# Altium schematic sheet 四开关buck-boost主电路.SchDoc
size A4
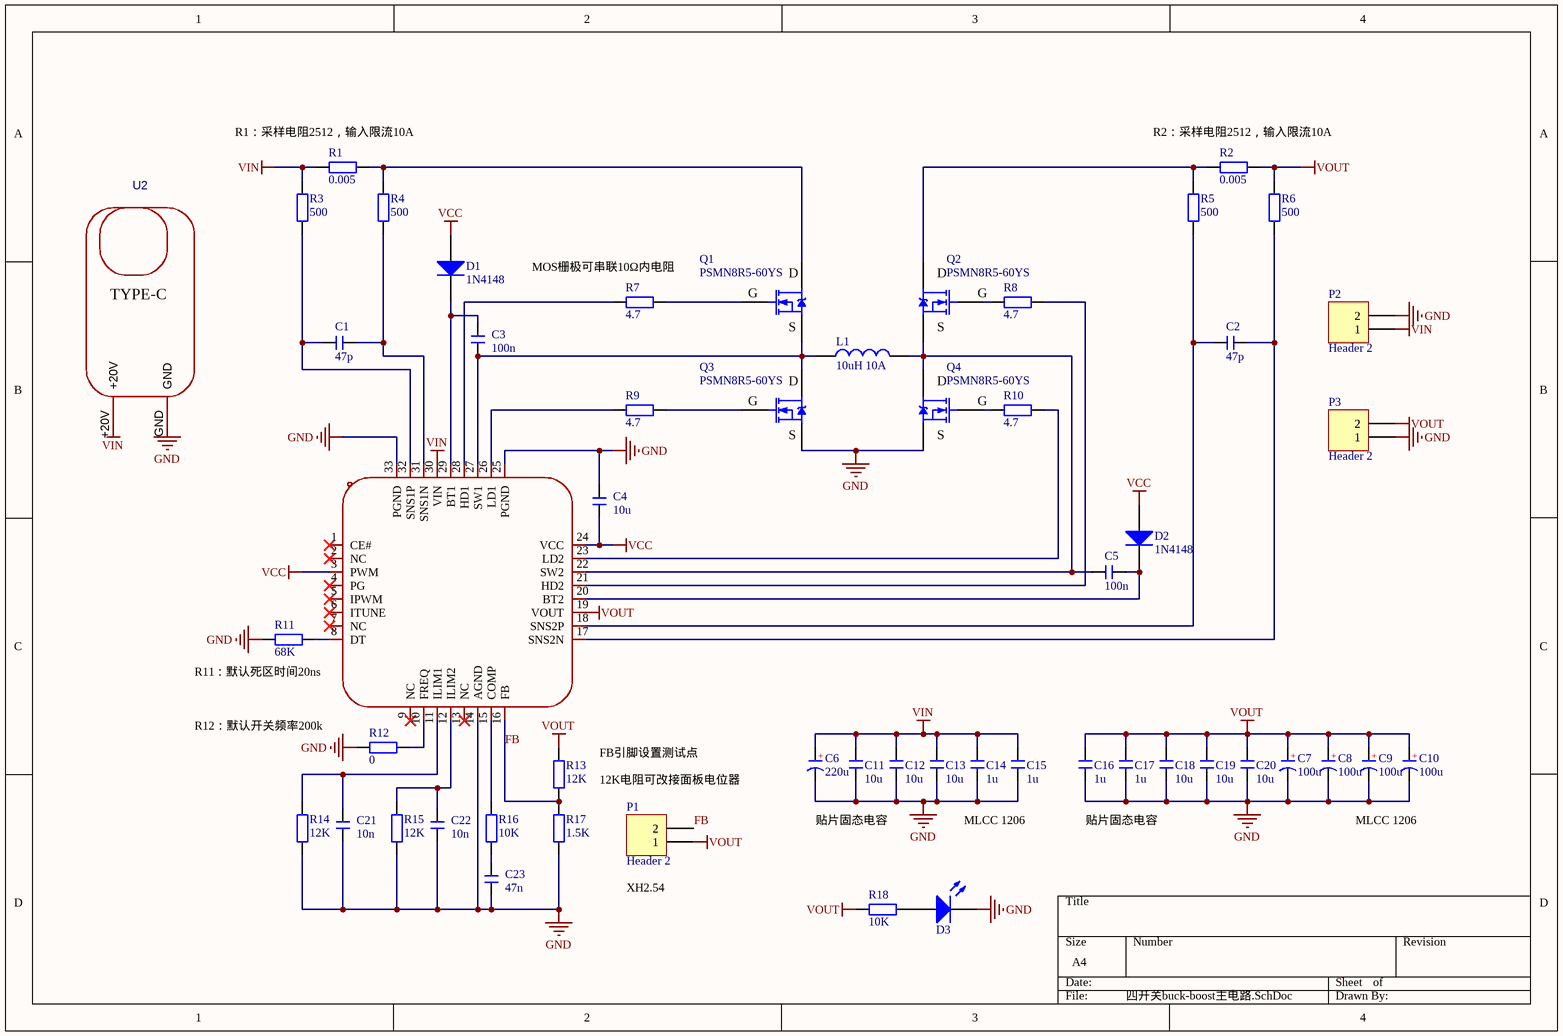
[diagram p0: 四开关buck-boost主电路.SchDoc]

## Parts
C1  47p  [C 0603_M]
C2  47p  [C 0603_M]
C3  100n  [C 0603_M]
C4  10u  [C 0603_M]
C5  100n  [C 0603_M]
C6  220u  [CM F(10*10.2)]
C7  100u  [CM E(8*10.2)]
C8  100u  [CM E(8*10.2)]
C9  100u  [CM E(8*10.2)]
C10  100u  [CM E(8*10.2)]
C11  10u  [C 1206_M]
C12  10u  [C 1206_M]
C13  10u  [C 1206_M]
C14  1u  [C 1206_M]
C15  1u  [C 1206_M]
C16  1u  [C 1206_M]
C17  1u  [C 1206_M]
C18  10u  [C 1206_M]
C19  10u  [C 1206_M]
C20  10u  [C 1206_M]
C21  10n  [C 0603_M]
C22  10n  [C 0603_M]
C23  47n  [C 0603_M]
D1  1N4148  [SOD-323]
D2  1N4148  [SOD-323]
D3  LED  [LED 0603G]  (value not drawn)
L1  10uH 10A  [IND-SMD_L13.8-W12.6_SMMS1360]
P1  Header 2  [HDR1X2]
P2  Header 2  [CONN-TH_2P-P3.81_WJ15EDGRC-3.81-2P]
P3  Header 2  [CONN-TH_2P-P3.81_WJ15EDGRC-3.81-2P]
Q1  PSMN8R5-60YS  [SOT669]
Q2  PSMN8R5-60YS  [SOT669]
Q3  PSMN8R5-60YS  [SOT669]
Q4  PSMN8R5-60YS  [SOT669]
R1  0.005  [R 2512_M]
R2  0.005  [R 2512_M]
R3  500  [R 0603_M]
R4  500  [R 0603_M]
R5  500  [R 0603_M]
R6  500  [R 0603_M]
R7  4.7  [R 0603_M]
R8  4.7  [R 0603_M]
R9  4.7  [R 0603_M]
R10  4.7  [R 0603_M]
R11  68K  [R 0603_M]
R12  0  [R 0603_M]
R13  12K  [R 0603_M]
R14  12K  [R 0603_M]
R15  12K  [R 0603_M]
R16  10K  [R 0603_M]
R17  1.5K  [R 0603_M]
R18  10K  [R 0603_M]
U1  SC8701QDER  [QFN-32_L4.0-W4.0-P0.4-BL-EP2.6]  (value not drawn)
U2  PD2.0/3.0诱骗器TYPE-C  [PD2.0/3.0诱骗器]  (value not drawn)

## Nets
GND: C4.2 C6.2(K) C7.2(K) C8.2(K) C9.2(K) C10.2(K) C11.1 C12.1 C13.1 C14.1 C15.1 C16.1 C17.1 C18.1 C19.1 C20.1 C21.1 C22.1 C23.1 D3.2(K) P2.2 P3.1 Q3.3(S) Q4.3(S) R11.2 R12.2 R14.2 R15.2 R17.1 U1.14(AGND) U1.25(PGND) U1.33(PGND) U2.GND
VCC: C4.1 D1.1(A) D2.1(A) U1.3(PWM) U1.24(VCC)
VIN: C6.1(A) C11.2 C12.2 C13.2 C14.2 C15.2 P2.1 R1.1 R3.2 U1.30(VIN) U2.+20V
VOUT: C7.1(A) C8.1(A) C9.1(A) C10.1(A) C16.2 C17.2 C18.2 C19.2 C20.2 P1.1 P3.2 R2.2 R6.2 R13.1 R18.2 U1.19(VOUT)
FB: P1.2 R13.2 R17.2 U1.16(FB)
NetC1_1: C1.1 R4.1 U1.31(SNS1N)
NetC1_2: C1.2 R3.1 U1.32(SNS1P)
NetC2_1: C2.1 R6.1 U1.17(SNS2N)
NetC2_2: C2.2 R5.1 U1.18(SNS2P)
NetC3_1: C3.1 L1.1 Q1.3(S) Q3.2(D) U1.27(SW1)
NetC3_2: C3.2 D1.2(K) U1.29(BT1)
NetC5_1: C5.1 D2.2(K) U1.20(BT2)
NetC5_2: C5.2 L1.2 Q2.3(S) Q4.2(D) U1.22(SW2)
NetC21_2: C21.2 R14.1 U1.11(ILIM1)
NetC22_2: C22.2 R15.1 U1.12(ILIM2)
NetC23_2: C23.2 R16.2
NetD3_1: D3.1(A) R18.1
NetQ1_1: Q1.1(G) R7.2
NetQ1_2: Q1.2(D) R1.2 R4.2
NetQ2_1: Q2.1(G) R8.1
NetQ2_2: Q2.2(D) R2.1 R5.2
NetQ3_1: Q3.1(G) R9.2
NetQ4_1: Q4.1(G) R10.1
NetR7_1: R7.1 U1.28(HD1)
NetR8_2: R8.2 U1.21(HD2)
NetR9_1: R9.1 U1.26(LD1)
NetR10_2: R10.2 U1.23(LD2)
NetR11_1: R11.1 U1.8(DT)
NetR12_1: R12.1 U1.10(FREQ)
NetR16_1: R16.1 U1.15(COMP)

Not connected (* = marked no-connect by the designer): U1 1(CE#)* 2(NC)* 4(PG)* 5(IPWM)* 6(ITUNE)* 7(NC)* 9(NC)* 13(NC)*

## Notes on the sheet
- (near R1) R1：采样电阻2512，输入限流10A
- (near R2) R2：采样电阻2512，输入限流10A
- (near R7) MOS栅极可串联10Ω内电阻
- (near R11) R11：默认死区时间20ns
- R12：默认开关频率200k
- 12K电阻可改接面板电位器
- FB引脚设置测试点
- 贴片固态电容
- MLCC 1206
- (near P1) XH2.54
- (in symbol CE) +
- (in symbol PD2.0/3.0诱骗器TYPE-C) TYPE-C

## Library data of the parts
C1-C5 C11-C23 = C: 贴片电容; BOM名称: 无极性贴片电容; 淘宝ID: 封装库来自淘宝 ID：黄晶宝石; 联系售后，技术支持: https://shop463601444.taobao.com; 唯一出售店铺网址: https://shop463601444.taobao.com
C6-C10 = CE: 直插电解电容; 淘宝ID: 封装库来自淘宝 ID：黄晶宝石; BOM名称: 直插电解电容; 联系售后: https://item.taobao.com/item.htm?id=566775463719
D1 D2 = Diode: Default Diode; Published: 8-Jun-2000; LatestRevisionDate: 17-Jul-2002; LatestRevisionNote: Re-released for DXP Platform.; PackageVersion: Sep-1996; PackageReference: SMC; Publisher: Altium Limited; PackageDescription: DO-214-AB/SMC; 2 C-Bend Leads; Body 7.9 x 5.9 mm, inc. leads (LxW); Code_JEDEC: DO-214-AB
D3 = LED: 发光二极管; 技术支持，联系售后: https://shop463601444.taobao.com
L1 = L: 小功率贴片电感; 淘宝ID: 封装库来自淘宝 ID：黄晶宝石; 封装库来自淘宝卖家 ID：黄晶宝石: 其他店铺购入均为盗版，不享受售后技术支持服务，请立即申请退款; BOM名称: 小功率贴片电感; 联系售后: https://item.taobao.com/item.htm?id=566775463719
P1-P3 = Header 2: Header, 2-Pin; LatestRevisionDate: 17-Jul-2002; LatestRevisionNote: Re-released for DXP Platform.; Publisher: Altium Limited
Q1-Q4 = IRF840: N沟场效应管; BOM名称: N沟场效应管; 技术支持，联系售后: https://item.taobao.com/item.htm?id=566775463719
R1-R18 = R: 贴片电阻; 版权归属: 来自淘宝 ID：黄晶宝石; 封装库来自淘宝卖家 ID：黄晶宝石: 其他店铺购入均为盗版，不享受售后技术支持服务，请立即申请退款; BOM名称: 贴片电阻; 联系售后: https://item.taobao.com/item.htm?id=566775463719
U1 = SC8701QDER: Manufacturer: SOUTHCHIP(南芯); Add into BOM: yes; Symbol: SC8701QDER; Device: SC8701QDER; LCSC Part Name: SC8701QDER; Supplier Part: C252410; Manufacturer Part: SC8701QDER; Supplier Footprint: QFN-32-EP(4x4); JLCPCB Part Class: Extended Part; Datasheet: https://atta.szlcsc.com/upload/public/pdf/source/20180730/C252410_00C0301B447132D4D315788CEB176516.pdf; Supplier: LCSC; Convert to PCB: yes
U2 = PD2.0/3.0诱骗器TYPE-C: Convert to PCB: yes; Symbol: PD2.0/3.0诱骗器TYPE-C; Device: PD2.0/3.0诱骗器TYPE-C; Supplier Part: TAOBAO; Add into BOM: yes; Origin Footprint: PD2.0/3.0诱骗器